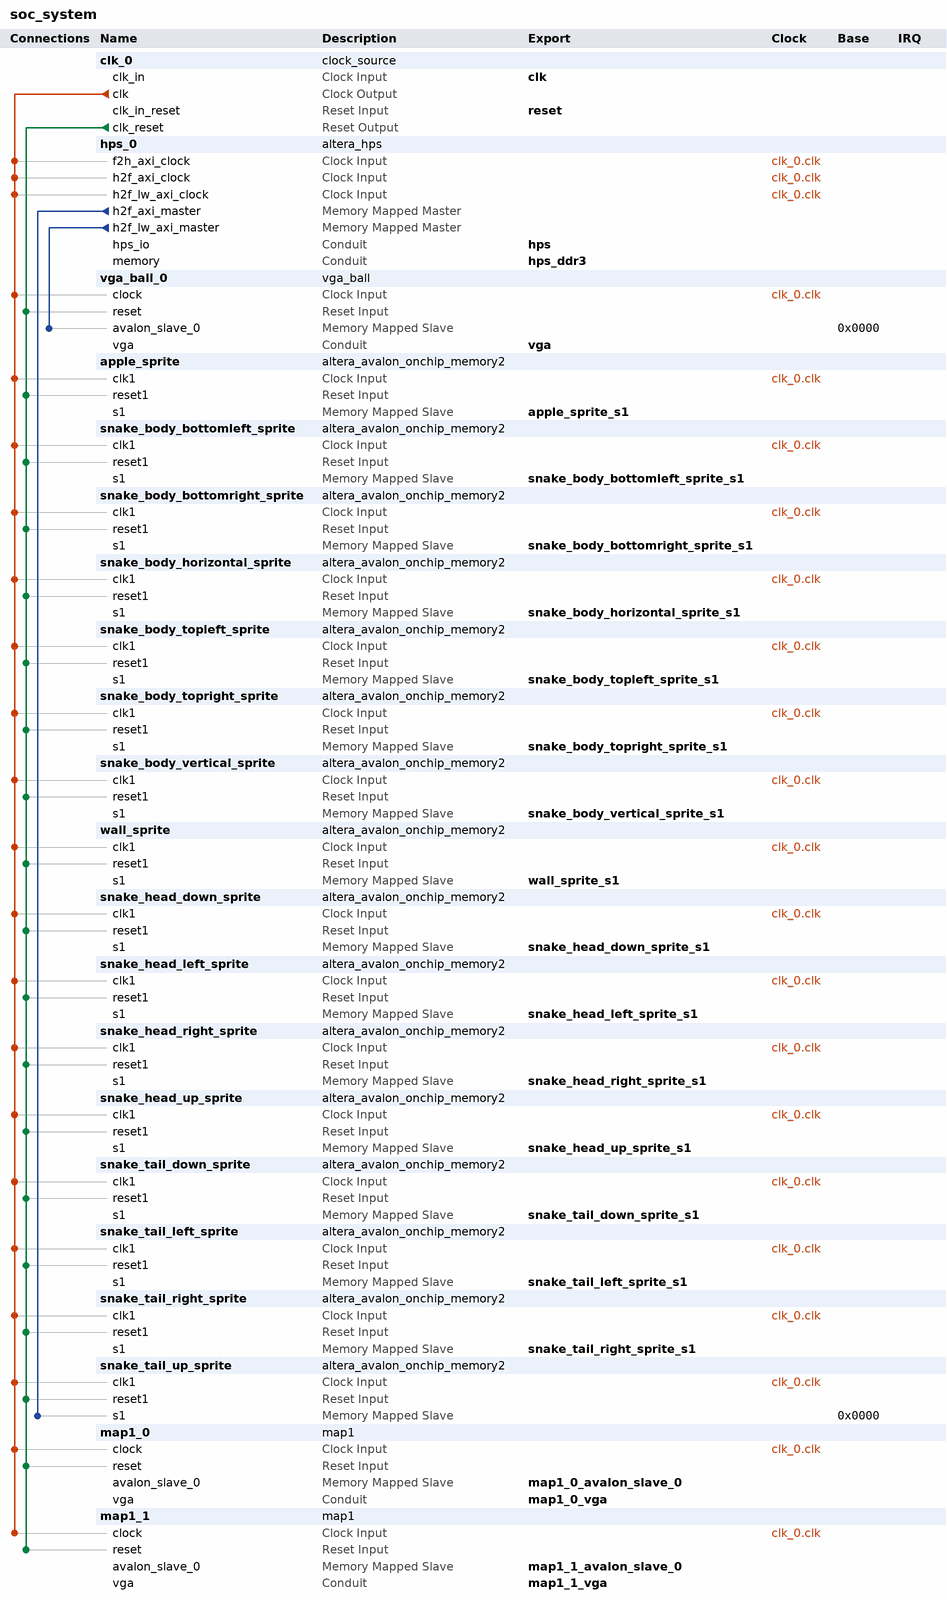
[diagram p0: system contents]
# Platform Designer (Qsys) system soc_system, Cyclone V 5CSEMA5F31C6
# Parameters at their usual value, and those the tool derives, are not listed.
package require -exact qsys 21.1
create_system soc_system
set_project_property DEVICE_FAMILY {Cyclone V}
set_project_property DEVICE 5CSEMA5F31C6

add_instance clk_0 clock_source 21.1
set_instance_parameter_value clk_0 clockFrequency 50000000

add_instance hps_0 altera_hps 21.1
set_instance_parameter_value hps_0 EMAC1_Mode RGMII
set_instance_parameter_value hps_0 EMAC1_PinMuxing {HPS I/O Set 0}
set_instance_parameter_value hps_0 F2SCLK_COLDRST_Enable false
set_instance_parameter_value hps_0 F2SCLK_DBGRST_Enable false
set_instance_parameter_value hps_0 F2SCLK_WARMRST_Enable false
set_instance_parameter_value hps_0 F2SINTERRUPT_Enable true
set_instance_parameter_value hps_0 F2S_Width 2
set_instance_parameter_value hps_0 FPGA_PERIPHERAL_OUTPUT_CLOCK_FREQ_EMAC0_GTX_CLK 125
set_instance_parameter_value hps_0 FPGA_PERIPHERAL_OUTPUT_CLOCK_FREQ_EMAC0_MD_CLK 2.5
set_instance_parameter_value hps_0 FPGA_PERIPHERAL_OUTPUT_CLOCK_FREQ_EMAC1_GTX_CLK 125
set_instance_parameter_value hps_0 FPGA_PERIPHERAL_OUTPUT_CLOCK_FREQ_EMAC1_MD_CLK 2.5
set_instance_parameter_value hps_0 HPS_PROTOCOL DDR3
set_instance_parameter_value hps_0 I2C0_Mode I2C
set_instance_parameter_value hps_0 I2C0_PinMuxing {HPS I/O Set 0}
set_instance_parameter_value hps_0 I2C1_Mode I2C
set_instance_parameter_value hps_0 I2C1_PinMuxing {HPS I/O Set 0}
set_instance_parameter_value hps_0 LWH2F_Enable true
set_instance_parameter_value hps_0 MEM_BANKADDR_WIDTH 3
set_instance_parameter_value hps_0 MEM_CLK_FREQ 400.0
set_instance_parameter_value hps_0 MEM_COL_ADDR_WIDTH 10
set_instance_parameter_value hps_0 MEM_DQ_WIDTH 32
set_instance_parameter_value hps_0 MEM_DRV_STR RZQ/7
set_instance_parameter_value hps_0 MEM_ROW_ADDR_WIDTH 15
set_instance_parameter_value hps_0 MEM_RTT_NOM RZQ/4
set_instance_parameter_value hps_0 MEM_RTT_WR RZQ/4
set_instance_parameter_value hps_0 MEM_TCL 11
set_instance_parameter_value hps_0 MEM_TFAW_NS 30.0
set_instance_parameter_value hps_0 MEM_TRAS_NS 35.0
set_instance_parameter_value hps_0 MEM_TRCD_NS 13.75
set_instance_parameter_value hps_0 MEM_TRFC_NS 260.0
set_instance_parameter_value hps_0 MEM_TRP_NS 13.75
set_instance_parameter_value hps_0 MEM_TRRD_NS 7.7
set_instance_parameter_value hps_0 MEM_VENDOR JEDEC
set_instance_parameter_value hps_0 MEM_WTCL 8
set_instance_parameter_value hps_0 QSPI_Mode N/A
set_instance_parameter_value hps_0 QSPI_PinMuxing Unused
set_instance_parameter_value hps_0 REF_CLK_FREQ 25.0
set_instance_parameter_value hps_0 S2FCLK_USER1CLK_Enable true
set_instance_parameter_value hps_0 S2FCLK_USER1CLK_FREQ 50.0
set_instance_parameter_value hps_0 S2FCLK_USER2CLK 5
set_instance_parameter_value hps_0 S2F_Width 2
set_instance_parameter_value hps_0 SDIO_Mode {4-bit Data}
set_instance_parameter_value hps_0 SDIO_PinMuxing {HPS I/O Set 0}
set_instance_parameter_value hps_0 SPIM1_Mode {Single Slave Select}
set_instance_parameter_value hps_0 SPIM1_PinMuxing {HPS I/O Set 0}
set_instance_parameter_value hps_0 STM_Enable false
set_instance_parameter_value hps_0 TIMING_BOARD_AC_SKEW 0.03
set_instance_parameter_value hps_0 TIMING_BOARD_AC_TO_CK_SKEW 0.0
set_instance_parameter_value hps_0 TIMING_BOARD_DQ_TO_DQS_SKEW 0.0
set_instance_parameter_value hps_0 TIMING_BOARD_MAX_CK_DELAY 0.03
set_instance_parameter_value hps_0 TIMING_BOARD_MAX_DQS_DELAY 0.02
set_instance_parameter_value hps_0 TIMING_BOARD_SKEW_BETWEEN_DQS 0.08
set_instance_parameter_value hps_0 TIMING_BOARD_SKEW_CKDQS_DIMM_MAX 0.16
set_instance_parameter_value hps_0 TIMING_BOARD_SKEW_CKDQS_DIMM_MIN 0.09
set_instance_parameter_value hps_0 TIMING_BOARD_SKEW_WITHIN_DQS 0.01
set_instance_parameter_value hps_0 TIMING_TDH 65
set_instance_parameter_value hps_0 TIMING_TDQSCK 255
set_instance_parameter_value hps_0 TIMING_TDQSQ 125
set_instance_parameter_value hps_0 TIMING_TDS 30
set_instance_parameter_value hps_0 TIMING_TIH 140
set_instance_parameter_value hps_0 TIMING_TIS 180
set_instance_parameter_value hps_0 TIMING_TQSH 0.4
set_instance_parameter_value hps_0 UART0_Mode {No Flow Control}
set_instance_parameter_value hps_0 UART0_PinMuxing {HPS I/O Set 0}
set_instance_parameter_value hps_0 USB1_Mode SDR
set_instance_parameter_value hps_0 USB1_PinMuxing {HPS I/O Set 0}
set_instance_parameter_value hps_0 desired_cfg_clk_mhz 50.0
set_instance_parameter_value hps_0 desired_qspi_clk_mhz 400.0

add_instance vga_ball_0 vga_ball 1.0

add_instance apple_sprite altera_avalon_onchip_memory2 21.1
set_instance_parameter_value apple_sprite dataWidth 16
set_instance_parameter_value apple_sprite dualPort false
set_instance_parameter_value apple_sprite initMemContent true
set_instance_parameter_value apple_sprite initializationFileName /user/stud/fall22/sm5169/Documents/embedded/Embedded-System-Final-Project/snake/python/mif_output_16/mif_apple.mif
set_instance_parameter_value apple_sprite memorySize 512
set_instance_parameter_value apple_sprite useNonDefaultInitFile true
set_instance_parameter_value apple_sprite writable false

add_instance snake_body_bottomleft_sprite altera_avalon_onchip_memory2 21.1
set_instance_parameter_value snake_body_bottomleft_sprite dataWidth 16
set_instance_parameter_value snake_body_bottomleft_sprite dualPort false
set_instance_parameter_value snake_body_bottomleft_sprite initMemContent true
set_instance_parameter_value snake_body_bottomleft_sprite initializationFileName /user/stud/fall22/sm5169/Documents/embedded/Embedded-System-Final-Project/snake/python/mif_output_16/mif_body_bottomleft.mif
set_instance_parameter_value snake_body_bottomleft_sprite memorySize 512
set_instance_parameter_value snake_body_bottomleft_sprite useNonDefaultInitFile true
set_instance_parameter_value snake_body_bottomleft_sprite writable false

add_instance snake_body_bottomright_sprite altera_avalon_onchip_memory2 21.1
set_instance_parameter_value snake_body_bottomright_sprite dataWidth 16
set_instance_parameter_value snake_body_bottomright_sprite dualPort false
set_instance_parameter_value snake_body_bottomright_sprite initMemContent true
set_instance_parameter_value snake_body_bottomright_sprite initializationFileName /user/stud/fall22/sm5169/Documents/embedded/Embedded-System-Final-Project/snake/python/mif_output_16/mif_body_bottomright.mif
set_instance_parameter_value snake_body_bottomright_sprite memorySize 512
set_instance_parameter_value snake_body_bottomright_sprite useNonDefaultInitFile true
set_instance_parameter_value snake_body_bottomright_sprite writable false

add_instance snake_body_horizontal_sprite altera_avalon_onchip_memory2 21.1
set_instance_parameter_value snake_body_horizontal_sprite dataWidth 16
set_instance_parameter_value snake_body_horizontal_sprite dualPort false
set_instance_parameter_value snake_body_horizontal_sprite initMemContent true
set_instance_parameter_value snake_body_horizontal_sprite initializationFileName /user/stud/fall22/sm5169/Documents/embedded/Embedded-System-Final-Project/snake/python/mif_output_16/mif_body_horizontal.mif
set_instance_parameter_value snake_body_horizontal_sprite memorySize 512
set_instance_parameter_value snake_body_horizontal_sprite useNonDefaultInitFile true
set_instance_parameter_value snake_body_horizontal_sprite writable false

add_instance snake_body_topleft_sprite altera_avalon_onchip_memory2 21.1
set_instance_parameter_value snake_body_topleft_sprite dataWidth 16
set_instance_parameter_value snake_body_topleft_sprite dualPort false
set_instance_parameter_value snake_body_topleft_sprite initMemContent true
set_instance_parameter_value snake_body_topleft_sprite initializationFileName /user/stud/fall22/sm5169/Documents/embedded/Embedded-System-Final-Project/snake/python/mif_output_16/mif_body_topleft.mif
set_instance_parameter_value snake_body_topleft_sprite memorySize 512
set_instance_parameter_value snake_body_topleft_sprite useNonDefaultInitFile true
set_instance_parameter_value snake_body_topleft_sprite writable false

add_instance snake_body_topright_sprite altera_avalon_onchip_memory2 21.1
set_instance_parameter_value snake_body_topright_sprite dataWidth 16
set_instance_parameter_value snake_body_topright_sprite dualPort false
set_instance_parameter_value snake_body_topright_sprite initMemContent true
set_instance_parameter_value snake_body_topright_sprite initializationFileName /user/stud/fall22/sm5169/Documents/embedded/Embedded-System-Final-Project/snake/python/mif_output_16/mif_body_topright.mif
set_instance_parameter_value snake_body_topright_sprite memorySize 512
set_instance_parameter_value snake_body_topright_sprite useNonDefaultInitFile true
set_instance_parameter_value snake_body_topright_sprite writable false

add_instance snake_body_vertical_sprite altera_avalon_onchip_memory2 21.1
set_instance_parameter_value snake_body_vertical_sprite dataWidth 16
set_instance_parameter_value snake_body_vertical_sprite dualPort false
set_instance_parameter_value snake_body_vertical_sprite initMemContent true
set_instance_parameter_value snake_body_vertical_sprite initializationFileName /user/stud/fall22/sm5169/Documents/embedded/Embedded-System-Final-Project/snake/python/mif_output_16/mif_body_vertical.mif
set_instance_parameter_value snake_body_vertical_sprite memorySize 512
set_instance_parameter_value snake_body_vertical_sprite useNonDefaultInitFile true
set_instance_parameter_value snake_body_vertical_sprite writable false

add_instance wall_sprite altera_avalon_onchip_memory2 21.1
set_instance_parameter_value wall_sprite dataWidth 16
set_instance_parameter_value wall_sprite dualPort false
set_instance_parameter_value wall_sprite initMemContent true
set_instance_parameter_value wall_sprite initializationFileName /user/stud/fall22/sm5169/Documents/embedded/Embedded-System-Final-Project/snake/python/mif_output_16/mif_brick_wall.mif
set_instance_parameter_value wall_sprite memorySize 2048
set_instance_parameter_value wall_sprite useNonDefaultInitFile true
set_instance_parameter_value wall_sprite writable false

add_instance snake_head_down_sprite altera_avalon_onchip_memory2 21.1
set_instance_parameter_value snake_head_down_sprite dataWidth 16
set_instance_parameter_value snake_head_down_sprite dualPort false
set_instance_parameter_value snake_head_down_sprite initMemContent true
set_instance_parameter_value snake_head_down_sprite initializationFileName /user/stud/fall22/sm5169/Documents/embedded/Embedded-System-Final-Project/snake/python/mif_output_16/mif_head_down.mif
set_instance_parameter_value snake_head_down_sprite memorySize 512
set_instance_parameter_value snake_head_down_sprite useNonDefaultInitFile true
set_instance_parameter_value snake_head_down_sprite writable false

add_instance snake_head_left_sprite altera_avalon_onchip_memory2 21.1
set_instance_parameter_value snake_head_left_sprite dataWidth 16
set_instance_parameter_value snake_head_left_sprite dualPort false
set_instance_parameter_value snake_head_left_sprite initMemContent true
set_instance_parameter_value snake_head_left_sprite initializationFileName /user/stud/fall22/sm5169/Documents/embedded/Embedded-System-Final-Project/snake/python/mif_output_16/mif_head_left.mif
set_instance_parameter_value snake_head_left_sprite memorySize 512
set_instance_parameter_value snake_head_left_sprite useNonDefaultInitFile true
set_instance_parameter_value snake_head_left_sprite writable false

add_instance snake_head_right_sprite altera_avalon_onchip_memory2 21.1
set_instance_parameter_value snake_head_right_sprite dataWidth 16
set_instance_parameter_value snake_head_right_sprite dualPort false
set_instance_parameter_value snake_head_right_sprite initMemContent true
set_instance_parameter_value snake_head_right_sprite initializationFileName /user/stud/fall22/sm5169/Documents/embedded/Embedded-System-Final-Project/snake/python/mif_output_16/mif_head_right.mif
set_instance_parameter_value snake_head_right_sprite memorySize 512
set_instance_parameter_value snake_head_right_sprite useNonDefaultInitFile true
set_instance_parameter_value snake_head_right_sprite writable false

add_instance snake_head_up_sprite altera_avalon_onchip_memory2 21.1
set_instance_parameter_value snake_head_up_sprite dataWidth 16
set_instance_parameter_value snake_head_up_sprite dualPort false
set_instance_parameter_value snake_head_up_sprite initMemContent true
set_instance_parameter_value snake_head_up_sprite initializationFileName /user/stud/fall22/sm5169/Documents/embedded/Embedded-System-Final-Project/snake/python/mif_output_16/mif_head_up.mif
set_instance_parameter_value snake_head_up_sprite memorySize 512
set_instance_parameter_value snake_head_up_sprite useNonDefaultInitFile true
set_instance_parameter_value snake_head_up_sprite writable false

add_instance snake_tail_down_sprite altera_avalon_onchip_memory2 21.1
set_instance_parameter_value snake_tail_down_sprite dataWidth 16
set_instance_parameter_value snake_tail_down_sprite dualPort false
set_instance_parameter_value snake_tail_down_sprite initMemContent true
set_instance_parameter_value snake_tail_down_sprite initializationFileName /user/stud/fall22/sm5169/Documents/embedded/Embedded-System-Final-Project/snake/python/mif_output_16/mif_tail_down.mif
set_instance_parameter_value snake_tail_down_sprite memorySize 512
set_instance_parameter_value snake_tail_down_sprite useNonDefaultInitFile true
set_instance_parameter_value snake_tail_down_sprite writable false

add_instance snake_tail_left_sprite altera_avalon_onchip_memory2 21.1
set_instance_parameter_value snake_tail_left_sprite dataWidth 16
set_instance_parameter_value snake_tail_left_sprite dualPort false
set_instance_parameter_value snake_tail_left_sprite initMemContent true
set_instance_parameter_value snake_tail_left_sprite initializationFileName /user/stud/fall22/sm5169/Documents/embedded/Embedded-System-Final-Project/snake/python/mif_output_16/mif_tail_left.mif
set_instance_parameter_value snake_tail_left_sprite memorySize 512
set_instance_parameter_value snake_tail_left_sprite useNonDefaultInitFile true
set_instance_parameter_value snake_tail_left_sprite writable false

add_instance snake_tail_right_sprite altera_avalon_onchip_memory2 21.1
set_instance_parameter_value snake_tail_right_sprite dataWidth 16
set_instance_parameter_value snake_tail_right_sprite dualPort false
set_instance_parameter_value snake_tail_right_sprite initMemContent true
set_instance_parameter_value snake_tail_right_sprite initializationFileName /user/stud/fall22/sm5169/Documents/embedded/Embedded-System-Final-Project/snake/python/mif_output_16/mif_tail_right.mif
set_instance_parameter_value snake_tail_right_sprite memorySize 512
set_instance_parameter_value snake_tail_right_sprite useNonDefaultInitFile true
set_instance_parameter_value snake_tail_right_sprite writable false

add_instance snake_tail_up_sprite altera_avalon_onchip_memory2 21.1
set_instance_parameter_value snake_tail_up_sprite dataWidth 16
set_instance_parameter_value snake_tail_up_sprite dualPort false
set_instance_parameter_value snake_tail_up_sprite initMemContent true
set_instance_parameter_value snake_tail_up_sprite initializationFileName /user/stud/fall22/sm5169/Documents/embedded/Embedded-System-Final-Project/snake/python/mif_output_16/mif_tail_up.mif
set_instance_parameter_value snake_tail_up_sprite memorySize 512
set_instance_parameter_value snake_tail_up_sprite useNonDefaultInitFile true
set_instance_parameter_value snake_tail_up_sprite writable false

add_instance map1_0 map1 1.0

add_instance map1_1 map1 1.0

# connections
add_connection clk_0.clk apple_sprite.clk1 clock
add_connection clk_0.clk hps_0.f2h_axi_clock clock
add_connection clk_0.clk hps_0.h2f_axi_clock clock
add_connection clk_0.clk hps_0.h2f_lw_axi_clock clock
add_connection clk_0.clk map1_0.clock clock
add_connection clk_0.clk map1_1.clock clock
add_connection clk_0.clk snake_body_bottomleft_sprite.clk1 clock
add_connection clk_0.clk snake_body_bottomright_sprite.clk1 clock
add_connection clk_0.clk snake_body_horizontal_sprite.clk1 clock
add_connection clk_0.clk snake_body_topleft_sprite.clk1 clock
add_connection clk_0.clk snake_body_topright_sprite.clk1 clock
add_connection clk_0.clk snake_body_vertical_sprite.clk1 clock
add_connection clk_0.clk snake_head_down_sprite.clk1 clock
add_connection clk_0.clk snake_head_left_sprite.clk1 clock
add_connection clk_0.clk snake_head_right_sprite.clk1 clock
add_connection clk_0.clk snake_head_up_sprite.clk1 clock
add_connection clk_0.clk snake_tail_down_sprite.clk1 clock
add_connection clk_0.clk snake_tail_left_sprite.clk1 clock
add_connection clk_0.clk snake_tail_right_sprite.clk1 clock
add_connection clk_0.clk snake_tail_up_sprite.clk1 clock
add_connection clk_0.clk vga_ball_0.clock clock
add_connection clk_0.clk wall_sprite.clk1 clock
add_connection clk_0.clk_reset apple_sprite.reset1 reset
add_connection clk_0.clk_reset map1_0.reset reset
add_connection clk_0.clk_reset map1_1.reset reset
add_connection clk_0.clk_reset snake_body_bottomleft_sprite.reset1 reset
add_connection clk_0.clk_reset snake_body_bottomright_sprite.reset1 reset
add_connection clk_0.clk_reset snake_body_horizontal_sprite.reset1 reset
add_connection clk_0.clk_reset snake_body_topleft_sprite.reset1 reset
add_connection clk_0.clk_reset snake_body_topright_sprite.reset1 reset
add_connection clk_0.clk_reset snake_body_vertical_sprite.reset1 reset
add_connection clk_0.clk_reset snake_head_down_sprite.reset1 reset
add_connection clk_0.clk_reset snake_head_left_sprite.reset1 reset
add_connection clk_0.clk_reset snake_head_right_sprite.reset1 reset
add_connection clk_0.clk_reset snake_head_up_sprite.reset1 reset
add_connection clk_0.clk_reset snake_tail_down_sprite.reset1 reset
add_connection clk_0.clk_reset snake_tail_left_sprite.reset1 reset
add_connection clk_0.clk_reset snake_tail_right_sprite.reset1 reset
add_connection clk_0.clk_reset snake_tail_up_sprite.reset1 reset
add_connection clk_0.clk_reset vga_ball_0.reset reset
add_connection clk_0.clk_reset wall_sprite.reset1 reset
add_connection hps_0.h2f_axi_master snake_tail_up_sprite.s1 avalon
set_connection_parameter_value hps_0.h2f_axi_master/snake_tail_up_sprite.s1 baseAddress 0x0000
add_connection hps_0.h2f_lw_axi_master vga_ball_0.avalon_slave_0 avalon
set_connection_parameter_value hps_0.h2f_lw_axi_master/vga_ball_0.avalon_slave_0 baseAddress 0x0000

# exported interfaces
add_interface apple_sprite_s1 avalon slave
set_interface_property apple_sprite_s1 EXPORT_OF apple_sprite.s1
add_interface clk clock sink
set_interface_property clk EXPORT_OF clk_0.clk_in
add_interface hps conduit end
set_interface_property hps EXPORT_OF hps_0.hps_io
add_interface hps_ddr3 conduit end
set_interface_property hps_ddr3 EXPORT_OF hps_0.memory
add_interface map1_0_avalon_slave_0 avalon slave
set_interface_property map1_0_avalon_slave_0 EXPORT_OF map1_0.avalon_slave_0
add_interface map1_0_vga conduit end
set_interface_property map1_0_vga EXPORT_OF map1_0.vga
add_interface map1_1_avalon_slave_0 avalon slave
set_interface_property map1_1_avalon_slave_0 EXPORT_OF map1_1.avalon_slave_0
add_interface map1_1_vga conduit end
set_interface_property map1_1_vga EXPORT_OF map1_1.vga
add_interface reset reset sink
set_interface_property reset EXPORT_OF clk_0.clk_in_reset
add_interface snake_body_bottomleft_sprite_s1 avalon slave
set_interface_property snake_body_bottomleft_sprite_s1 EXPORT_OF snake_body_bottomleft_sprite.s1
add_interface snake_body_bottomright_sprite_s1 avalon slave
set_interface_property snake_body_bottomright_sprite_s1 EXPORT_OF snake_body_bottomright_sprite.s1
add_interface snake_body_horizontal_sprite_s1 avalon slave
set_interface_property snake_body_horizontal_sprite_s1 EXPORT_OF snake_body_horizontal_sprite.s1
add_interface snake_body_topleft_sprite_s1 avalon slave
set_interface_property snake_body_topleft_sprite_s1 EXPORT_OF snake_body_topleft_sprite.s1
add_interface snake_body_topright_sprite_s1 avalon slave
set_interface_property snake_body_topright_sprite_s1 EXPORT_OF snake_body_topright_sprite.s1
add_interface snake_body_vertical_sprite_s1 avalon slave
set_interface_property snake_body_vertical_sprite_s1 EXPORT_OF snake_body_vertical_sprite.s1
add_interface snake_head_down_sprite_s1 avalon slave
set_interface_property snake_head_down_sprite_s1 EXPORT_OF snake_head_down_sprite.s1
add_interface snake_head_left_sprite_s1 avalon slave
set_interface_property snake_head_left_sprite_s1 EXPORT_OF snake_head_left_sprite.s1
add_interface snake_head_right_sprite_s1 avalon slave
set_interface_property snake_head_right_sprite_s1 EXPORT_OF snake_head_right_sprite.s1
add_interface snake_head_up_sprite_s1 avalon slave
set_interface_property snake_head_up_sprite_s1 EXPORT_OF snake_head_up_sprite.s1
add_interface snake_tail_down_sprite_s1 avalon slave
set_interface_property snake_tail_down_sprite_s1 EXPORT_OF snake_tail_down_sprite.s1
add_interface snake_tail_left_sprite_s1 avalon slave
set_interface_property snake_tail_left_sprite_s1 EXPORT_OF snake_tail_left_sprite.s1
add_interface snake_tail_right_sprite_s1 avalon slave
set_interface_property snake_tail_right_sprite_s1 EXPORT_OF snake_tail_right_sprite.s1
add_interface vga conduit end
set_interface_property vga EXPORT_OF vga_ball_0.vga
add_interface wall_sprite_s1 avalon slave
set_interface_property wall_sprite_s1 EXPORT_OF wall_sprite.s1

set_interconnect_requirement {$system} qsys_mm.clockCrossingAdapter HANDSHAKE
set_interconnect_requirement {$system} qsys_mm.enableEccProtection FALSE
set_interconnect_requirement {$system} qsys_mm.insertDefaultSlave FALSE
set_interconnect_requirement {$system} qsys_mm.maxAdditionalLatency 1

save_system soc_system.qsys
